# EAGLE schematic Stroboscope (EAGLE 6.6.0)
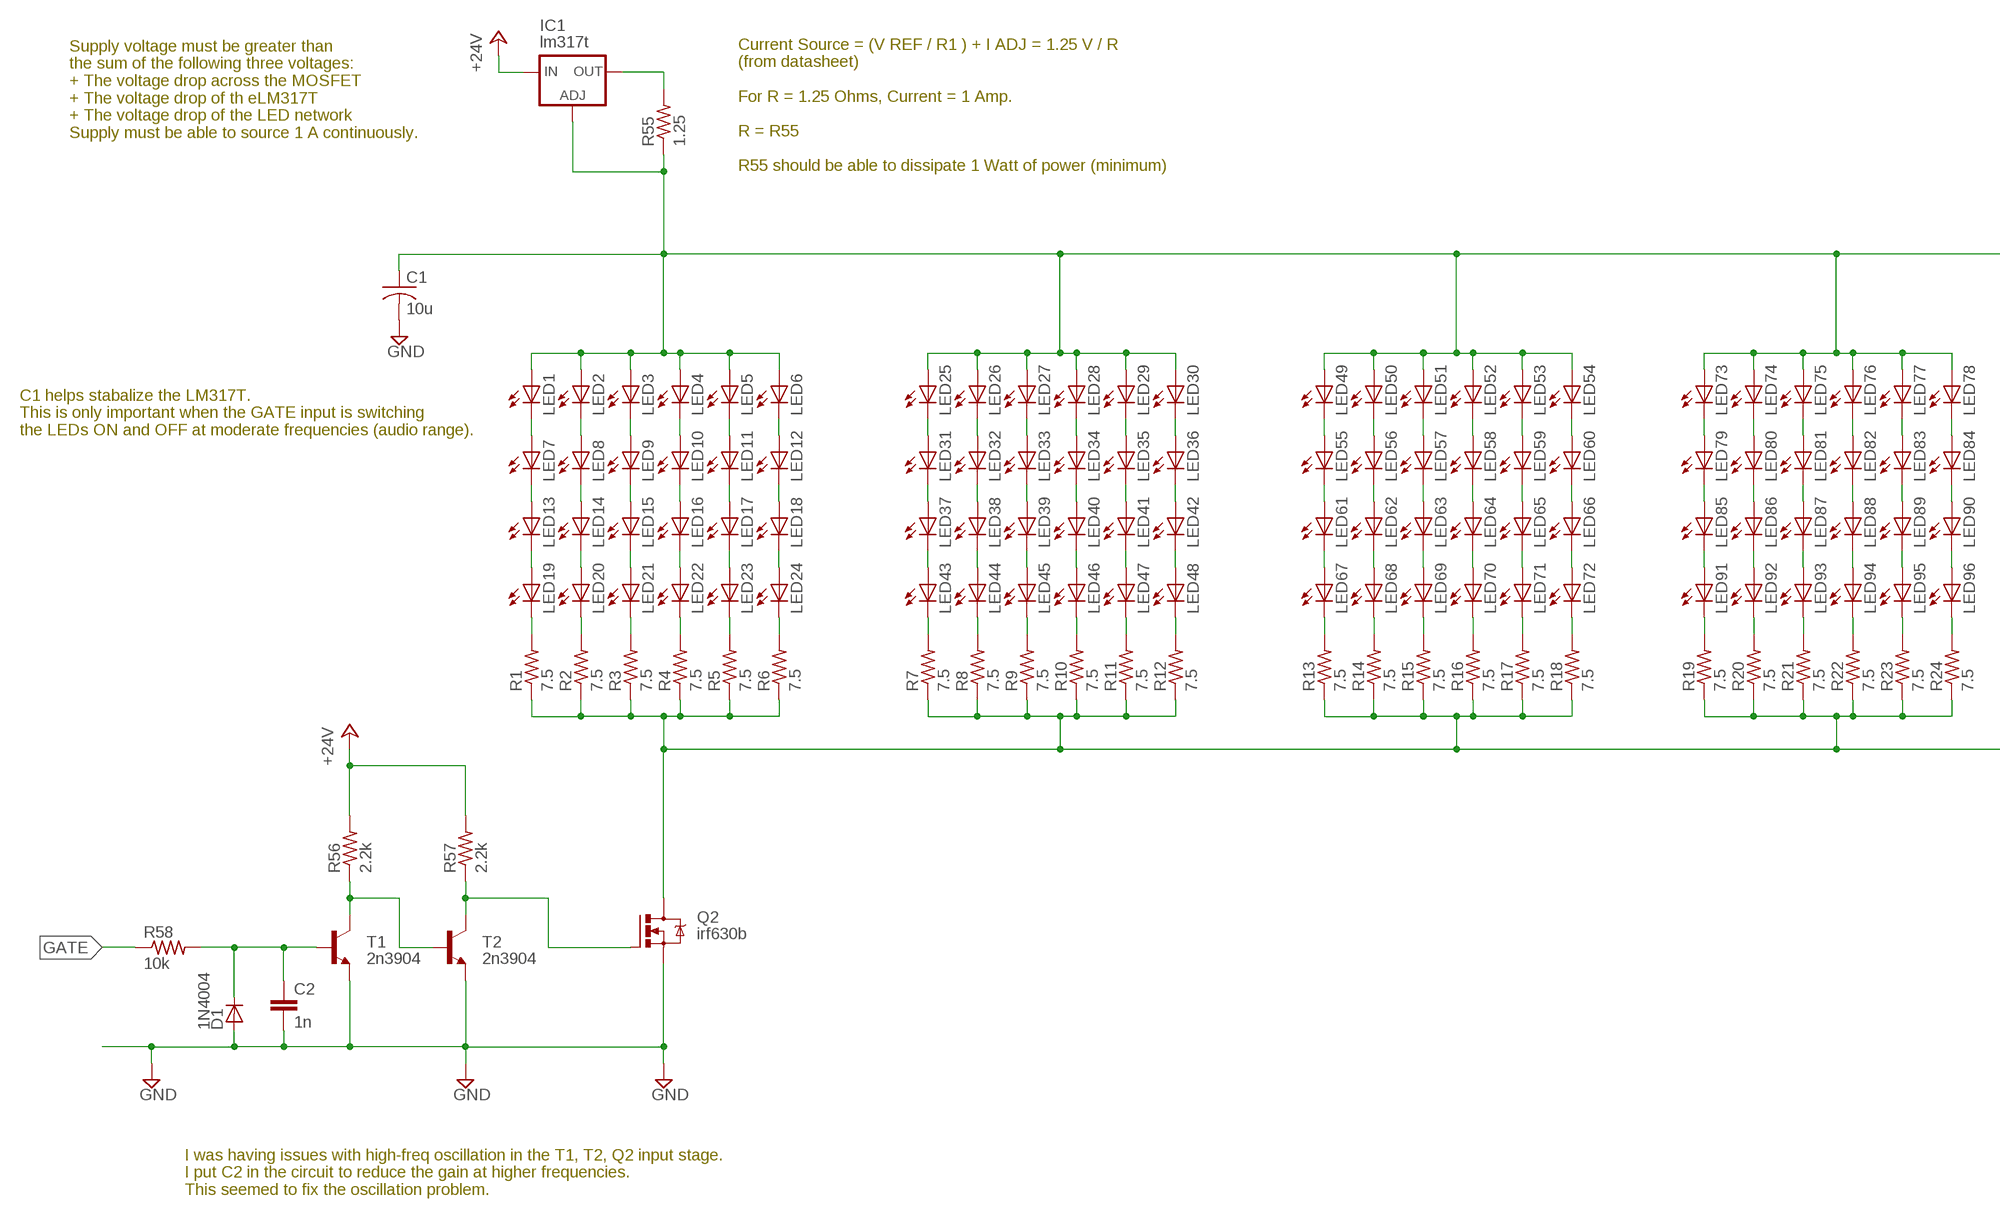
[diagram p0: schematic, sheet 1, part 1 of 2]
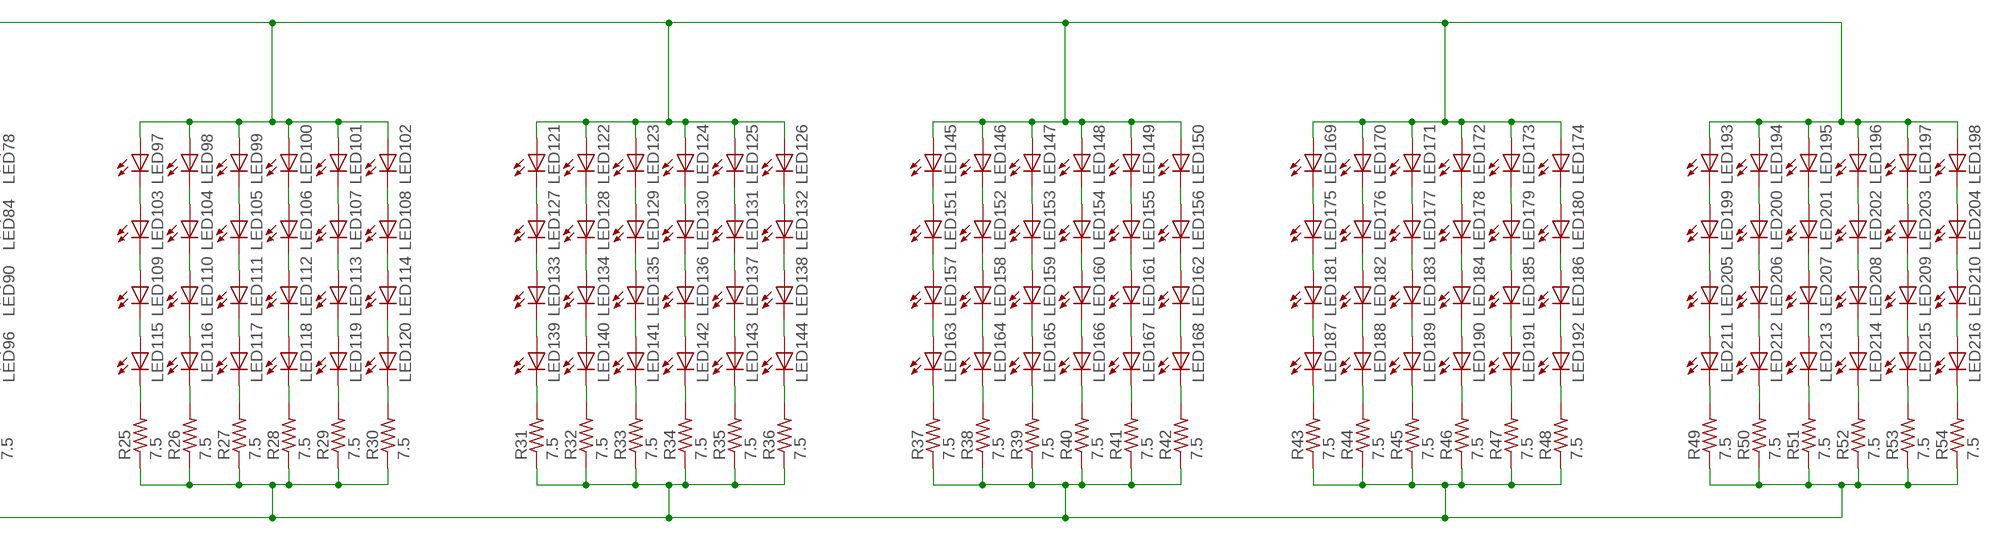
[diagram p1: schematic, sheet 1, part 2 of 2]

## Parts
C1  10u  C-US025-050X050  [C025-050X050]
C2  1n  C-EU025-024X044  [C025-024X044]
D1  1N4004  [DO41-10]
IC1  lm317t  LM317TL  [317TL]
LED1  LED5MM  [LED5MM]
LED2  LED5MM  [LED5MM]
LED3  LED5MM  [LED5MM]
LED4  LED5MM  [LED5MM]
LED5  LED5MM  [LED5MM]
LED6  LED5MM  [LED5MM]
LED7  LED5MM  [LED5MM]
LED8  LED5MM  [LED5MM]
LED9  LED5MM  [LED5MM]
LED10  LED5MM  [LED5MM]
LED11  LED5MM  [LED5MM]
LED12  LED5MM  [LED5MM]
LED13  LED5MM  [LED5MM]
LED14  LED5MM  [LED5MM]
LED15  LED5MM  [LED5MM]
LED16  LED5MM  [LED5MM]
LED17  LED5MM  [LED5MM]
LED18  LED5MM  [LED5MM]
LED19  LED5MM  [LED5MM]
LED20  LED5MM  [LED5MM]
LED21  LED5MM  [LED5MM]
LED22  LED5MM  [LED5MM]
LED23  LED5MM  [LED5MM]
LED24  LED5MM  [LED5MM]
LED25  LED5MM  [LED5MM]
LED26  LED5MM  [LED5MM]
LED27  LED5MM  [LED5MM]
LED28  LED5MM  [LED5MM]
LED29  LED5MM  [LED5MM]
LED30  LED5MM  [LED5MM]
LED31  LED5MM  [LED5MM]
LED32  LED5MM  [LED5MM]
LED33  LED5MM  [LED5MM]
LED34  LED5MM  [LED5MM]
LED35  LED5MM  [LED5MM]
LED36  LED5MM  [LED5MM]
LED37  LED5MM  [LED5MM]
LED38  LED5MM  [LED5MM]
LED39  LED5MM  [LED5MM]
LED40  LED5MM  [LED5MM]
LED41  LED5MM  [LED5MM]
LED42  LED5MM  [LED5MM]
LED43  LED5MM  [LED5MM]
LED44  LED5MM  [LED5MM]
LED45  LED5MM  [LED5MM]
LED46  LED5MM  [LED5MM]
LED47  LED5MM  [LED5MM]
LED48  LED5MM  [LED5MM]
LED49  LED5MM  [LED5MM]
LED50  LED5MM  [LED5MM]
LED51  LED5MM  [LED5MM]
LED52  LED5MM  [LED5MM]
LED53  LED5MM  [LED5MM]
LED54  LED5MM  [LED5MM]
LED55  LED5MM  [LED5MM]
LED56  LED5MM  [LED5MM]
LED57  LED5MM  [LED5MM]
LED58  LED5MM  [LED5MM]
LED59  LED5MM  [LED5MM]
LED60  LED5MM  [LED5MM]
LED61  LED5MM  [LED5MM]
LED62  LED5MM  [LED5MM]
LED63  LED5MM  [LED5MM]
LED64  LED5MM  [LED5MM]
LED65  LED5MM  [LED5MM]
LED66  LED5MM  [LED5MM]
LED67  LED5MM  [LED5MM]
LED68  LED5MM  [LED5MM]
LED69  LED5MM  [LED5MM]
LED70  LED5MM  [LED5MM]
LED71  LED5MM  [LED5MM]
LED72  LED5MM  [LED5MM]
LED73  LED5MM  [LED5MM]
LED74  LED5MM  [LED5MM]
LED75  LED5MM  [LED5MM]
LED76  LED5MM  [LED5MM]
LED77  LED5MM  [LED5MM]
LED78  LED5MM  [LED5MM]
LED79  LED5MM  [LED5MM]
LED80  LED5MM  [LED5MM]
LED81  LED5MM  [LED5MM]
LED82  LED5MM  [LED5MM]
LED83  LED5MM  [LED5MM]
LED84  LED5MM  [LED5MM]
LED85  LED5MM  [LED5MM]
LED86  LED5MM  [LED5MM]
LED87  LED5MM  [LED5MM]
LED88  LED5MM  [LED5MM]
LED89  LED5MM  [LED5MM]
LED90  LED5MM  [LED5MM]
LED91  LED5MM  [LED5MM]
LED92  LED5MM  [LED5MM]
LED93  LED5MM  [LED5MM]
LED94  LED5MM  [LED5MM]
LED95  LED5MM  [LED5MM]
LED96  LED5MM  [LED5MM]
LED97  LED5MM  [LED5MM]
LED98  LED5MM  [LED5MM]
LED99  LED5MM  [LED5MM]
LED100  LED5MM  [LED5MM]
LED101  LED5MM  [LED5MM]
LED102  LED5MM  [LED5MM]
LED103  LED5MM  [LED5MM]
LED104  LED5MM  [LED5MM]
LED105  LED5MM  [LED5MM]
LED106  LED5MM  [LED5MM]
LED107  LED5MM  [LED5MM]
LED108  LED5MM  [LED5MM]
LED109  LED5MM  [LED5MM]
LED110  LED5MM  [LED5MM]
LED111  LED5MM  [LED5MM]
LED112  LED5MM  [LED5MM]
LED113  LED5MM  [LED5MM]
LED114  LED5MM  [LED5MM]
LED115  LED5MM  [LED5MM]
LED116  LED5MM  [LED5MM]
LED117  LED5MM  [LED5MM]
LED118  LED5MM  [LED5MM]
LED119  LED5MM  [LED5MM]
LED120  LED5MM  [LED5MM]
LED121  LED5MM  [LED5MM]
LED122  LED5MM  [LED5MM]
LED123  LED5MM  [LED5MM]
LED124  LED5MM  [LED5MM]
LED125  LED5MM  [LED5MM]
LED126  LED5MM  [LED5MM]
LED127  LED5MM  [LED5MM]
LED128  LED5MM  [LED5MM]
LED129  LED5MM  [LED5MM]
LED130  LED5MM  [LED5MM]
LED131  LED5MM  [LED5MM]
LED132  LED5MM  [LED5MM]
LED133  LED5MM  [LED5MM]
LED134  LED5MM  [LED5MM]
LED135  LED5MM  [LED5MM]
LED136  LED5MM  [LED5MM]
LED137  LED5MM  [LED5MM]
LED138  LED5MM  [LED5MM]
LED139  LED5MM  [LED5MM]
LED140  LED5MM  [LED5MM]
LED141  LED5MM  [LED5MM]
LED142  LED5MM  [LED5MM]
LED143  LED5MM  [LED5MM]
LED144  LED5MM  [LED5MM]
LED145  LED5MM  [LED5MM]
LED146  LED5MM  [LED5MM]
LED147  LED5MM  [LED5MM]
LED148  LED5MM  [LED5MM]
LED149  LED5MM  [LED5MM]
LED150  LED5MM  [LED5MM]
LED151  LED5MM  [LED5MM]
LED152  LED5MM  [LED5MM]
LED153  LED5MM  [LED5MM]
LED154  LED5MM  [LED5MM]
LED155  LED5MM  [LED5MM]
LED156  LED5MM  [LED5MM]
LED157  LED5MM  [LED5MM]
LED158  LED5MM  [LED5MM]
LED159  LED5MM  [LED5MM]
LED160  LED5MM  [LED5MM]
LED161  LED5MM  [LED5MM]
LED162  LED5MM  [LED5MM]
LED163  LED5MM  [LED5MM]
LED164  LED5MM  [LED5MM]
LED165  LED5MM  [LED5MM]
LED166  LED5MM  [LED5MM]
LED167  LED5MM  [LED5MM]
LED168  LED5MM  [LED5MM]
LED169  LED5MM  [LED5MM]
LED170  LED5MM  [LED5MM]
LED171  LED5MM  [LED5MM]
LED172  LED5MM  [LED5MM]
LED173  LED5MM  [LED5MM]
LED174  LED5MM  [LED5MM]
LED175  LED5MM  [LED5MM]
LED176  LED5MM  [LED5MM]
LED177  LED5MM  [LED5MM]
LED178  LED5MM  [LED5MM]
LED179  LED5MM  [LED5MM]
LED180  LED5MM  [LED5MM]
LED181  LED5MM  [LED5MM]
LED182  LED5MM  [LED5MM]
LED183  LED5MM  [LED5MM]
LED184  LED5MM  [LED5MM]
LED185  LED5MM  [LED5MM]
LED186  LED5MM  [LED5MM]
LED187  LED5MM  [LED5MM]
LED188  LED5MM  [LED5MM]
LED189  LED5MM  [LED5MM]
LED190  LED5MM  [LED5MM]
LED191  LED5MM  [LED5MM]
LED192  LED5MM  [LED5MM]
LED193  LED5MM  [LED5MM]
LED194  LED5MM  [LED5MM]
LED195  LED5MM  [LED5MM]
LED196  LED5MM  [LED5MM]
LED197  LED5MM  [LED5MM]
LED198  LED5MM  [LED5MM]
LED199  LED5MM  [LED5MM]
LED200  LED5MM  [LED5MM]
LED201  LED5MM  [LED5MM]
LED202  LED5MM  [LED5MM]
LED203  LED5MM  [LED5MM]
LED204  LED5MM  [LED5MM]
LED205  LED5MM  [LED5MM]
LED206  LED5MM  [LED5MM]
LED207  LED5MM  [LED5MM]
LED208  LED5MM  [LED5MM]
LED209  LED5MM  [LED5MM]
LED210  LED5MM  [LED5MM]
LED211  LED5MM  [LED5MM]
LED212  LED5MM  [LED5MM]
LED213  LED5MM  [LED5MM]
LED214  LED5MM  [LED5MM]
LED215  LED5MM  [LED5MM]
LED216  LED5MM  [LED5MM]
Q2  irf630b  IRLZ44Z  [TO220BH]
R1  7.5  R-US_0204/7  [0204/7]
R2  7.5  R-US_0204/7  [0204/7]
R3  7.5  R-US_0204/7  [0204/7]
R4  7.5  R-US_0204/7  [0204/7]
R5  7.5  R-US_0204/7  [0204/7]
R6  7.5  R-US_0204/7  [0204/7]
R7  7.5  R-US_0204/7  [0204/7]
R8  7.5  R-US_0204/7  [0204/7]
R9  7.5  R-US_0204/7  [0204/7]
R10  7.5  R-US_0204/7  [0204/7]
R11  7.5  R-US_0204/7  [0204/7]
R12  7.5  R-US_0204/7  [0204/7]
R13  7.5  R-US_0204/7  [0204/7]
R14  7.5  R-US_0204/7  [0204/7]
R15  7.5  R-US_0204/7  [0204/7]
R16  7.5  R-US_0204/7  [0204/7]
R17  7.5  R-US_0204/7  [0204/7]
R18  7.5  R-US_0204/7  [0204/7]
R19  7.5  R-US_0204/7  [0204/7]
R20  7.5  R-US_0204/7  [0204/7]
R21  7.5  R-US_0204/7  [0204/7]
R22  7.5  R-US_0204/7  [0204/7]
R23  7.5  R-US_0204/7  [0204/7]
R24  7.5  R-US_0204/7  [0204/7]
R25  7.5  R-US_0204/7  [0204/7]
R26  7.5  R-US_0204/7  [0204/7]
R27  7.5  R-US_0204/7  [0204/7]
R28  7.5  R-US_0204/7  [0204/7]
R29  7.5  R-US_0204/7  [0204/7]
R30  7.5  R-US_0204/7  [0204/7]
R31  7.5  R-US_0204/7  [0204/7]
R32  7.5  R-US_0204/7  [0204/7]
R33  7.5  R-US_0204/7  [0204/7]
R34  7.5  R-US_0204/7  [0204/7]
R35  7.5  R-US_0204/7  [0204/7]
R36  7.5  R-US_0204/7  [0204/7]
R37  7.5  R-US_0204/7  [0204/7]
R38  7.5  R-US_0204/7  [0204/7]
R39  7.5  R-US_0204/7  [0204/7]
R40  7.5  R-US_0204/7  [0204/7]
R41  7.5  R-US_0204/7  [0204/7]
R42  7.5  R-US_0204/7  [0204/7]
R43  7.5  R-US_0204/7  [0204/7]
R44  7.5  R-US_0204/7  [0204/7]
R45  7.5  R-US_0204/7  [0204/7]
R46  7.5  R-US_0204/7  [0204/7]
R47  7.5  R-US_0204/7  [0204/7]
R48  7.5  R-US_0204/7  [0204/7]
R49  7.5  R-US_0204/7  [0204/7]
R50  7.5  R-US_0204/7  [0204/7]
R51  7.5  R-US_0204/7  [0204/7]
R52  7.5  R-US_0204/7  [0204/7]
R53  7.5  R-US_0204/7  [0204/7]
R54  7.5  R-US_0204/7  [0204/7]
R55  1.25  R-US_0411/12  [0411/12]
R56  2.2k  R-US_0204/7  [0204/7]
R57  2.2k  R-US_0204/7  [0204/7]
R58  10k  R-US_0204/7  [0204/7]
T1  2n3904  -NPN-TO92  [TO92]
T2  2n3904  -NPN-TO92  [TO92]

## Nets
+18V: IC1.3(IN) ; supply symbol labelled +24V
+24V: R56.2 R57.2
GATE: R58.1
GND: C1.2 C2.2 D1.A Q2.S T1.1(E) T2.1(E)
N$1: LED1.K(C) LED7.A
N$2: LED2.K(C) LED8.A
N$3: LED3.K(C) LED9.A
N$4: LED4.K(C) LED10.A
N$5: LED5.K(C) LED11.A
N$6: LED6.K(C) LED12.A
N$7: LED7.K(C) LED13.A
N$8: LED8.K(C) LED14.A
N$9: LED9.K(C) LED15.A
N$10: LED10.K(C) LED16.A
N$11: LED11.K(C) LED17.A
N$12: LED12.K(C) LED18.A
N$13: LED13.K(C) LED19.A
N$14: LED14.K(C) LED20.A
N$15: LED15.K(C) LED21.A
N$16: LED16.K(C) LED22.A
N$17: LED17.K(C) LED23.A
N$18: LED18.K(C) LED24.A
N$19: LED19.K(C) R1.2
N$20: LED20.K(C) R2.2
N$21: LED21.K(C) R3.2
N$22: LED22.K(C) R4.2
N$23: LED23.K(C) R5.2
N$24: LED24.K(C) R6.2
N$25: Q2.D R1.1 R2.1 R3.1 R4.1 R5.1 R6.1 R7.1 R8.1 R9.1 R10.1 R11.1 R12.1 R13.1 R14.1 R15.1 R16.1 R17.1 R18.1 R19.1 R20.1 R21.1 R22.1 R23.1 R24.1 R25.1 R26.1 R27.1 R28.1 R29.1 R30.1 R31.1 R32.1 R33.1 R34.1 R35.1 R36.1 R37.1 R38.1 R39.1 R40.1 R41.1 R42.1 R43.1 R44.1 R45.1 R46.1 R47.1 R48.1 R49.1 R50.1 R51.1 R52.1 R53.1 R54.1
N$26: C2.1 D1.C R58.2 T1.2(B)
N$27: LED25.K(C) LED31.A
N$28: LED26.K(C) LED32.A
N$29: LED27.K(C) LED33.A
N$30: LED28.K(C) LED34.A
N$31: LED29.K(C) LED35.A
N$32: LED30.K(C) LED36.A
N$33: LED31.K(C) LED37.A
N$34: LED32.K(C) LED38.A
N$35: LED33.K(C) LED39.A
N$36: LED34.K(C) LED40.A
N$37: LED35.K(C) LED41.A
N$38: LED36.K(C) LED42.A
N$39: LED37.K(C) LED43.A
N$40: LED38.K(C) LED44.A
N$41: LED39.K(C) LED45.A
N$42: LED40.K(C) LED46.A
N$43: LED41.K(C) LED47.A
N$44: LED42.K(C) LED48.A
N$45: LED43.K(C) R7.2
N$46: LED44.K(C) R8.2
N$47: LED45.K(C) R9.2
N$48: LED46.K(C) R10.2
N$49: LED47.K(C) R11.2
N$50: LED48.K(C) R12.2
N$51: Q2.G R57.1 T2.3(C)
N$52: C1.1 IC1.1(ADJ) LED1.A LED2.A LED3.A LED4.A LED5.A LED6.A LED25.A LED26.A LED27.A LED28.A LED29.A LED30.A LED49.A LED50.A LED51.A LED52.A LED53.A LED54.A LED73.A LED74.A LED75.A LED76.A LED77.A LED78.A LED97.A LED98.A LED99.A LED100.A LED101.A LED102.A LED121.A LED122.A LED123.A LED124.A LED125.A LED126.A LED145.A LED146.A LED147.A LED148.A LED149.A LED150.A LED169.A LED170.A LED171.A LED172.A LED173.A LED174.A LED193.A LED194.A LED195.A LED196.A LED197.A LED198.A R55.1
N$53: LED49.K(C) LED55.A
N$54: LED50.K(C) LED56.A
N$55: LED51.K(C) LED57.A
N$56: LED52.K(C) LED58.A
N$57: LED53.K(C) LED59.A
N$58: LED54.K(C) LED60.A
N$59: LED55.K(C) LED61.A
N$60: LED56.K(C) LED62.A
N$61: LED57.K(C) LED63.A
N$62: LED58.K(C) LED64.A
N$63: LED59.K(C) LED65.A
N$64: LED60.K(C) LED66.A
N$65: LED61.K(C) LED67.A
N$66: LED62.K(C) LED68.A
N$67: LED63.K(C) LED69.A
N$68: LED64.K(C) LED70.A
N$69: LED65.K(C) LED71.A
N$70: LED66.K(C) LED72.A
N$71: LED67.K(C) R13.2
N$72: LED68.K(C) R14.2
N$73: LED69.K(C) R15.2
N$74: LED70.K(C) R16.2
N$75: LED71.K(C) R17.2
N$76: LED72.K(C) R18.2
N$77: R56.1 T1.3(C) T2.2(B)
N$79: LED73.K(C) LED79.A
N$80: LED74.K(C) LED80.A
N$81: LED75.K(C) LED81.A
N$82: LED76.K(C) LED82.A
N$83: LED77.K(C) LED83.A
N$84: LED78.K(C) LED84.A
N$85: LED79.K(C) LED85.A
N$86: LED80.K(C) LED86.A
N$87: LED81.K(C) LED87.A
N$88: LED82.K(C) LED88.A
N$89: LED83.K(C) LED89.A
N$90: LED84.K(C) LED90.A
N$91: LED85.K(C) LED91.A
N$92: LED86.K(C) LED92.A
N$93: LED87.K(C) LED93.A
N$94: LED88.K(C) LED94.A
N$95: LED89.K(C) LED95.A
N$96: LED90.K(C) LED96.A
N$97: LED91.K(C) R19.2
N$98: LED92.K(C) R20.2
N$99: LED93.K(C) R21.2
N$100: LED94.K(C) R22.2
N$101: LED95.K(C) R23.2
N$102: LED96.K(C) R24.2
N$105: LED97.K(C) LED103.A
N$106: LED98.K(C) LED104.A
N$107: LED99.K(C) LED105.A
N$108: LED100.K(C) LED106.A
N$109: LED101.K(C) LED107.A
N$110: LED102.K(C) LED108.A
N$111: LED103.K(C) LED109.A
N$112: LED104.K(C) LED110.A
N$113: LED105.K(C) LED111.A
N$114: LED106.K(C) LED112.A
N$115: LED107.K(C) LED113.A
N$116: LED108.K(C) LED114.A
N$117: LED109.K(C) LED115.A
N$118: LED110.K(C) LED116.A
N$119: LED111.K(C) LED117.A
N$120: LED112.K(C) LED118.A
N$121: LED113.K(C) LED119.A
N$122: LED114.K(C) LED120.A
N$123: LED115.K(C) R25.2
N$124: LED116.K(C) R26.2
N$125: LED117.K(C) R27.2
N$126: LED118.K(C) R28.2
N$127: LED119.K(C) R29.2
N$128: LED120.K(C) R30.2
N$131: LED121.K(C) LED127.A
N$132: LED122.K(C) LED128.A
N$133: LED123.K(C) LED129.A
N$134: LED124.K(C) LED130.A
N$135: LED125.K(C) LED131.A
N$136: LED126.K(C) LED132.A
N$137: LED127.K(C) LED133.A
N$138: LED128.K(C) LED134.A
N$139: LED129.K(C) LED135.A
N$140: LED130.K(C) LED136.A
N$141: LED131.K(C) LED137.A
N$142: LED132.K(C) LED138.A
N$143: LED133.K(C) LED139.A
N$144: LED134.K(C) LED140.A
N$145: LED135.K(C) LED141.A
N$146: LED136.K(C) LED142.A
N$147: LED137.K(C) LED143.A
N$148: LED138.K(C) LED144.A
N$149: LED139.K(C) R31.2
N$150: LED140.K(C) R32.2
N$151: LED141.K(C) R33.2
N$152: LED142.K(C) R34.2
N$153: LED143.K(C) R35.2
N$154: LED144.K(C) R36.2
N$157: LED145.K(C) LED151.A
N$158: LED146.K(C) LED152.A
N$159: LED147.K(C) LED153.A
N$160: LED148.K(C) LED154.A
N$161: LED149.K(C) LED155.A
N$162: LED150.K(C) LED156.A
N$163: LED151.K(C) LED157.A
N$164: LED152.K(C) LED158.A
N$165: LED153.K(C) LED159.A
N$166: LED154.K(C) LED160.A
N$167: LED155.K(C) LED161.A
N$168: LED156.K(C) LED162.A
N$169: LED157.K(C) LED163.A
N$170: LED158.K(C) LED164.A
N$171: LED159.K(C) LED165.A
N$172: LED160.K(C) LED166.A
N$173: LED161.K(C) LED167.A
N$174: LED162.K(C) LED168.A
N$175: LED163.K(C) R37.2
N$176: LED164.K(C) R38.2
N$177: LED165.K(C) R39.2
N$178: LED166.K(C) R40.2
N$179: LED167.K(C) R41.2
N$180: LED168.K(C) R42.2
N$183: LED169.K(C) LED175.A
N$184: LED170.K(C) LED176.A
N$185: LED171.K(C) LED177.A
N$186: LED172.K(C) LED178.A
N$187: LED173.K(C) LED179.A
N$188: LED174.K(C) LED180.A
N$189: LED175.K(C) LED181.A
N$190: LED176.K(C) LED182.A
N$191: LED177.K(C) LED183.A
N$192: LED178.K(C) LED184.A
N$193: LED179.K(C) LED185.A
N$194: LED180.K(C) LED186.A
N$195: LED181.K(C) LED187.A
N$196: LED182.K(C) LED188.A
N$197: LED183.K(C) LED189.A
N$198: LED184.K(C) LED190.A
N$199: LED185.K(C) LED191.A
N$200: LED186.K(C) LED192.A
N$201: LED187.K(C) R43.2
N$202: LED188.K(C) R44.2
N$203: LED189.K(C) R45.2
N$204: LED190.K(C) R46.2
N$205: LED191.K(C) R47.2
N$206: LED192.K(C) R48.2
N$209: LED193.K(C) LED199.A
N$210: LED194.K(C) LED200.A
N$211: LED195.K(C) LED201.A
N$212: LED196.K(C) LED202.A
N$213: LED197.K(C) LED203.A
N$214: LED198.K(C) LED204.A
N$215: LED199.K(C) LED205.A
N$216: LED200.K(C) LED206.A
N$217: LED201.K(C) LED207.A
N$218: LED202.K(C) LED208.A
N$219: LED203.K(C) LED209.A
N$220: LED204.K(C) LED210.A
N$221: LED205.K(C) LED211.A
N$222: LED206.K(C) LED212.A
N$223: LED207.K(C) LED213.A
N$224: LED208.K(C) LED214.A
N$225: LED209.K(C) LED215.A
N$226: LED210.K(C) LED216.A
N$227: LED211.K(C) R49.2
N$228: LED212.K(C) R50.2
N$229: LED213.K(C) R51.2
N$230: LED214.K(C) R52.2
N$231: LED215.K(C) R53.2
N$232: LED216.K(C) R54.2
N$235: IC1.2(OUT) R55.2

## Notes on the sheet
- Supply voltage must be greater than
  the sum of the following three voltages:
  + The voltage drop across the MOSFET
  + The voltage drop of th eLM317T
  + The voltage drop of the LED network
  Supply must be able to source 1 A continuously.
- Current Source = (V REF / R1 ) + I ADJ = 1.25 V / R
  (from datasheet)
  
  For R = 1.25 Ohms, Current = 1 Amp.
  
  R = R55
  
  R55 should be able to dissipate 1 Watt of power (minimum)
- C1 helps stabalize the LM317T.
  This is only important when the GATE input is switching
  the LEDs ON and OFF at moderate frequencies (audio range).
- I was having issues with high-freq oscillation in the T1, T2, Q2 input stage.
  I put C2 in the circuit to reduce the gain at higher frequencies.
  This seemed to fix the oscillation problem.

## Library data of the parts
C1 = rcl:C-US: CAPACITOR, American symbol
C2 = rcl:C-EU: CAPACITOR, European symbol
D1 = diode:1N4004: DIODE general purpose rectifier, 1 A
IC1 = v-reg:LM317TL: VOLTAGE REGULATOR
LED1-LED216 = led:LED: LED OSRAM: - CHIPLED LG R971, LG N971, LY N971, LG Q971, LY Q971, LO R971, LY R971 LH N974, LH R974 LS Q976, LO Q976, LY Q976 LO Q996 - Hyper CHIPLED LW Q18S LB Q993, LB Q99A, LB R99A - SideLED LS A670, LO A670, LY A670, LG A670, LP A670 LB A673, LV A673, LT A673, LW A673 LH A674 LY A675 LS A676, LA A676, LO A676, LY A676, LW A676 LS A679, LY A679, LG A679 - Hyper Micro SIDELED® LS Y876, LA Y876, LO Y876, LY Y876 LT Y87S - SmartLED LW L88C, LW L88S LB L89C, LB L89S, LG L890 LS L89K, LO L89K, LY L89K LS L896, LA L896, LO L896, LY L896 - TOPLED LS T670, LO T670, LY T670, LG T670, LP T670 LSG T670, LSP T670, LSY T670, LOP T670, LYG T670 LG T671, LOG T671, LSG T671 LB T673, LV T673, LT T673, LW T673 LH T674 LS T676, LA T676, LO T676, LY T676, LB T676, LH T676, LSB T676, LW T676 LB T67C, LV T67C, LT T67C, LS T67K, LO T67K, LY T67K, LW E67C LS E67B, LA E67B, LO E67B, LY E67B, LB E67C, LV E67C, LT E67C LW T67C LS T679, LY T679, LG T679 LS T770, LO T770, LY T770, LG T770, LP T770 LB T773, LV T773, LT T773, LW T773 LH T774 LS E675, LA E675, LY E675, LS T675 LS T776, LA T776, LO T776, LY T776, LB T776 LHGB T686 LT T68C, LB T68C - Hyper Mini TOPLED® LB M676 - Mini TOPLED Santana® LG M470 LS M47K, LO M47K, LY M47K Source: http://www.osram.convergy.de LUXEON: - LUMILED® LXK2-PW12-R00, LXK2-PW12-S00, LXK2-PW14-U00, LXK2-PW14-V00 LXK2-PM12-R00, LXK2-PM12-S00, LXK2-PM14-U00 LXK2-PE12-Q00, LXK2-PE12-R00, LXK2-PE12-S00, LXK2-PE14-T00, LXK2-PE14-U00 LXK2-PB12-K00, LXK2-PB12-L00, LXK2-PB12-M00, LXK2-PB14-N00, LXK2-PB14-P00, LXK2-PB14-Q00 LXK2-PR12-L00, LXK2-PR12-M00, LXK2-PR14-Q00, LXK2-PR14-R00 LXK2-PD12-Q00, LXK2-PD12-R00, LXK2-PD12-S00 LXK2-PH12-R00, LXK2-PH12-S00 LXK2-PL12-P00, LXK2-PL12-Q00, LXK2-PL12-R00 Source: www.luxeon.com KINGBRIGHT: KA-3528ASYC Source: www.kingbright.com
Q2 = transistor-power:IRLZ44Z: N-Channel HEXFET® Power MOSFET Logic Level AUTOMOTIVE MOSFET Source: http://www.irf.com/product-info/datasheets/data/irlz44zpbf.pdf
R1-R58 = rcl:R-US_: RESISTOR, American symbol
T1 T2 = transistor:*-NPN-: NPN Transistror BF959 corrected 2008.03.06